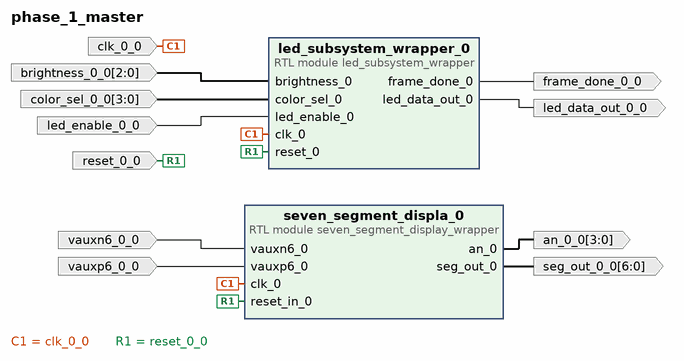
[diagram p0: block diagram of the top level]
# Vivado block design phase_1_master, xc7a35tcpg236-1, Vivado 2025.2
create_bd_design phase_1_master

create_bd_port -dir I clk_0_0
create_bd_port -dir I -type rst reset_0_0
create_bd_port -dir O led_data_out_0_0
create_bd_port -dir I led_enable_0_0
create_bd_port -dir I -from 3 -to 0 color_sel_0_0
create_bd_port -dir O -from 3 -to 0 an_0_0
create_bd_port -dir I vauxn6_0_0
create_bd_port -dir O frame_done_0_0
create_bd_port -dir I vauxp6_0_0
create_bd_port -dir O -from 6 -to 0 seg_out_0_0
create_bd_port -dir I -from 2 -to 0 brightness_0_0

create_bd_cell -type module -reference led_subsystem_wrapper led_subsystem_wrapper_0
create_bd_cell -type module -reference seven_segment_display_wrapper seven_segment_displa_0

# ---- connections ----

connect_bd_net -net brightness_0_0_1 [get_bd_ports brightness_0_0] [get_bd_pins led_subsystem_wrapper_0/brightness_0]
connect_bd_net -net clk_0_0_1 [get_bd_ports clk_0_0] [get_bd_pins led_subsystem_wrapper_0/clk_0] [get_bd_pins seven_segment_displa_0/clk_0]
connect_bd_net -net color_sel_0_0_1 [get_bd_ports color_sel_0_0] [get_bd_pins led_subsystem_wrapper_0/color_sel_0]
connect_bd_net -net led_enable_0_0_1 [get_bd_ports led_enable_0_0] [get_bd_pins led_subsystem_wrapper_0/led_enable_0]
connect_bd_net [get_bd_pins led_subsystem_wrapper_0/frame_done_0] [get_bd_ports frame_done_0_0]
connect_bd_net [get_bd_pins led_subsystem_wrapper_0/led_data_out_0] [get_bd_ports led_data_out_0_0]
connect_bd_net -net reset_0_0_1 [get_bd_ports reset_0_0] [get_bd_pins led_subsystem_wrapper_0/reset_0] [get_bd_pins seven_segment_displa_0/reset_in_0]
connect_bd_net [get_bd_pins seven_segment_displa_0/an_0] [get_bd_ports an_0_0]
connect_bd_net [get_bd_pins seven_segment_displa_0/seg_out_0] [get_bd_ports seg_out_0_0]
connect_bd_net -net vauxn6_0_0_1 [get_bd_ports vauxn6_0_0] [get_bd_pins seven_segment_displa_0/vauxn6_0]
connect_bd_net -net vauxp6_0_0_1 [get_bd_ports vauxp6_0_0] [get_bd_pins seven_segment_displa_0/vauxp6_0]

validate_bd_design
save_bd_design
